# EAGLE design invader_midplate (EAGLE 9.5.0)
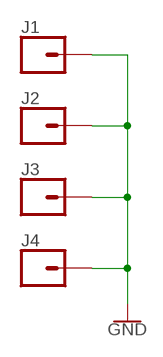
[diagram p0: schematic, sheet 1]

## Parts
J1  CONN_01PTH_NO_SILK_KIT  [1X01NS_KIT]
J2  CONN_01PTH_NO_SILK_KIT  [1X01NS_KIT]
J3  CONN_01PTH_NO_SILK_KIT  [1X01NS_KIT]
J4  CONN_01PTH_NO_SILK_KIT  [1X01NS_KIT]

## Nets
GND: J1.1 J2.1 J3.1 J4.1

## Library data of the parts
J1-J4 = SparkFun-Connectors:CONN_01: Single connection point. Often used as Generic Header-pin footprint for 0.1 inch spaced/style header connections On any of the 0.1 inch spaced packages, you can populate with these: Break Away Headers - Straight <https://www.sparkfun.com/products/116> (PRT-00116) Break Away Male Headers - Right Angle <https://www.sparkfun.com/products/553> (PRT-00553) Female Headers <https://www.sparkfun.com/products/115> (PRT-00115) Break Away Headers - Machine Pin <https://www.sparkfun.com/products/117> (PRT-00117) Break Away Female Headers - Swiss Machine Pin <https://www.sparkfun.com/products/743> (PRT-00743) This device is also useful as a general connection point to wire up your design to another part of your project. Our various solder wires solder well into these plated through hole pads. Hook-Up Wire - Assortment (Stranded, 22 AWG) <https://www.sparkfun.com/products/11375> (PRT-11375) Hook-Up Wire - Assortment (Solid Core, 22 AWG) <https://www.sparkfun.com/products/11367> (PRT-11367) View the entire wire category on our website here <https://www.sparkfun.com/categories/141> Special notes: SMTSO-256-ET is a "flush mount" nut for a 4-40 screw. We mostly use this on specialty testbeds; it is a nice way to connect hardware to your PCB at an adjustable hieght. Also note, the SNAP packages are for using a snappable style connector. We sell a baggie of snaps and they are also used on two LilyPad designs: Snap Assortment - 30 pack (male and female) <https://www.sparkfun.com/products/11347> (DEV-11347) LilyPad Arduino SimpleSnap <https://www.sparkfun.com/products/10941> (DEV-10941) LilyPad SimpleSnap Protoboard <https://www.sparkfun.com/products/10940> (DEV-10940)

## Net classes
0 default: width 0.152 mm
1 VCC: width 0.508 mm

## Board
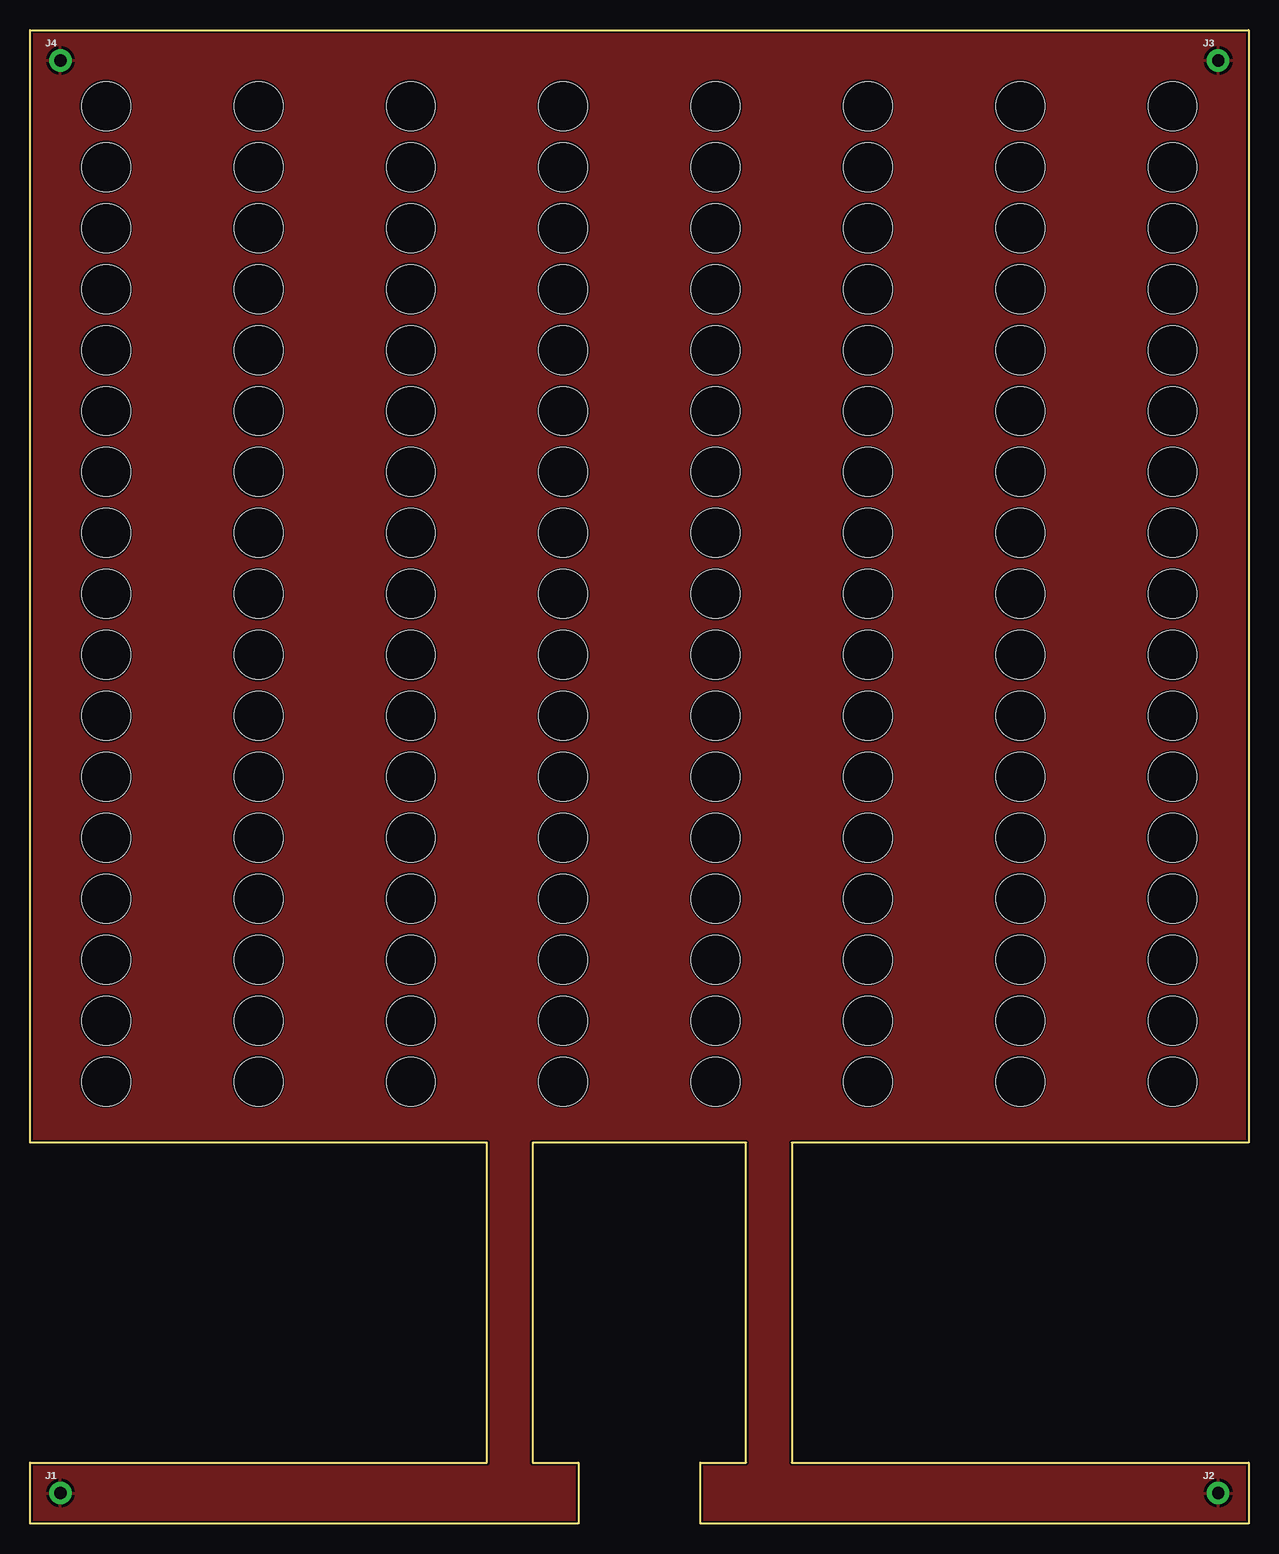
[diagram p1: board, top side]
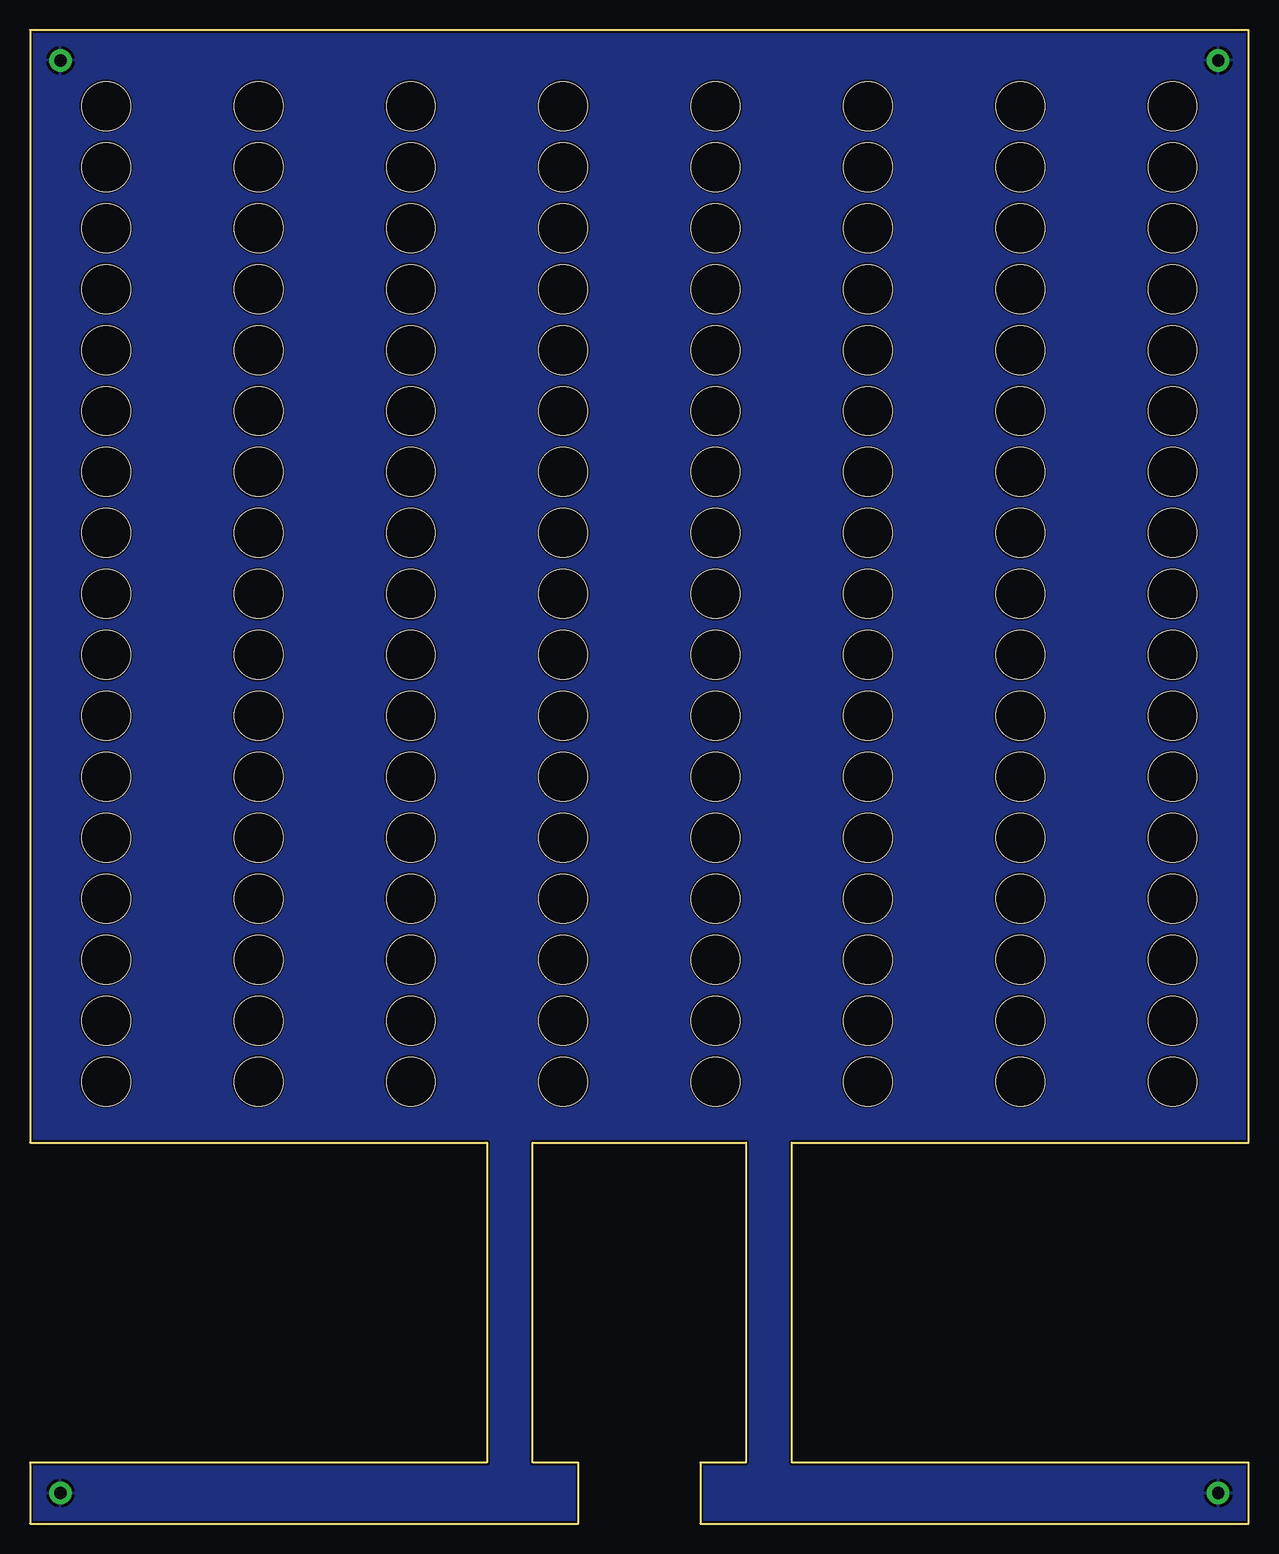
[diagram p2: board, bottom side, seen from below]

Size 101.6 x 124.46 mm. Coordinates in mm from the lower left corner, seen from the top.
Outline: 0,0 0,5.08 38.1,5.08 38.1,31.75 0,31.75 0,124.46 101.6,124.46 101.6,31.75 63.5,31.75 63.5,5.08 101.6,5.08 101.6,0 55.88,0 55.88,5.08 59.69,5.08 59.69,31.75 41.91,31.75 41.91,5.08 45.72,5.08 45.72,0 0,0
Copper layers (1*16): Top 0.035mm / dielectric 1.5mm / Bottom 0.035mm
Design rules "SparkFun-2-layer-PCBWay-LIMIT": minimum track width 6mil, minimum drill 0.3mm, track to track 6mil, track to pad 6mil, pad to pad 6mil, via to via 6mil, smd to smd 6mil, copper to edge 6mil, drill to drill 6mil, minimum pad ring 6mil, minimum via ring 6mil, stop-mask expansion 4mil, vias tented up to drill 25mil, thermal gap 10mil
Holes 4.06 mm at 6.35,118.11 19.05,118.11 31.75,118.11 44.45,118.11 57.15,118.11 69.85,118.11 82.55,118.11 95.25,118.11 6.35,113.03 19.05,113.03 31.75,113.03 44.45,113.03 57.15,113.03 69.85,113.03 82.55,113.03 95.25,113.03 6.35,107.95 19.05,107.95 31.75,107.95 44.45,107.95 57.15,107.95 69.85,107.95 82.55,107.95 95.25,107.95 6.35,102.87 19.05,102.87 31.75,102.87 44.45,102.87 57.15,102.87 69.85,102.87 82.55,102.87 95.25,102.87 6.35,97.79 19.05,97.79 31.75,97.79 44.45,97.79 57.15,97.79 69.85,97.79 82.55,97.79 95.25,97.79 6.35,92.71 19.05,92.71 31.75,92.71 44.45,92.71 57.15,92.71 69.85,92.71 82.55,92.71 95.25,92.71 6.35,87.63 19.05,87.63 31.75,87.63 44.45,87.63 57.15,87.63 69.85,87.63 82.55,87.63 95.25,87.63 6.35,82.55 19.05,82.55 31.75,82.55 44.45,82.55 57.15,82.55 69.85,82.55 82.55,82.55 95.25,82.55 6.35,77.47 19.05,77.47 31.75,77.47 44.45,77.47 57.15,77.47 69.85,77.47 82.55,77.47 95.25,77.47 6.35,72.39 19.05,72.39 31.75,72.39 44.45,72.39 57.15,72.39 69.85,72.39 82.55,72.39 95.25,72.39 6.35,67.31 19.05,67.31 31.75,67.31 44.45,67.31 57.15,67.31 69.85,67.31 82.55,67.31 95.25,67.31 6.35,62.23 19.05,62.23 31.75,62.23 44.45,62.23 57.15,62.23 69.85,62.23 82.55,62.23 95.25,62.23 6.35,57.15 19.05,57.15 31.75,57.15 44.45,57.15 57.15,57.15 69.85,57.15 82.55,57.15 95.25,57.15 6.35,52.07 19.05,52.07 31.75,52.07 44.45,52.07 57.15,52.07 69.85,52.07 82.55,52.07 95.25,52.07 6.35,46.99 19.05,46.99 31.75,46.99 44.45,46.99 57.15,46.99 69.85,46.99 82.55,46.99 95.25,46.99 6.35,41.91 19.05,41.91 31.75,41.91 44.45,41.91 57.15,41.91 69.85,41.91 82.55,41.91 95.25,41.91 6.35,36.83 19.05,36.83 31.75,36.83 44.45,36.83 57.15,36.83 69.85,36.83 82.55,36.83 95.25,36.83

### Footprints (pad centres in the part's own frame; a part is rotated, then mirrored left to right if it is on the bottom)
1X01NS_KIT = drill 1.016 pad 1.88: 1 0,0

### Placement (x,y rotation side)
J1  2.54,2.54 0 top
J2  99.06,2.54 0 top
J3  99.06,121.92 0 top
J4  2.54,121.92 0 top

### Tracks (layer width: path | path; a pad name or v marks a point on that pad's centre or on a via)
GND
  pour Top: 0,124.46 101.6,124.46 101.6,31.75 63.5,31.75 63.5,5.08 101.6,5.08 101.6,0 55.88,0 55.88,5.08 59.69,5.08 59.69,31.75 41.91,31.75 41.91,5.08 45.72,5.08 45.72,0 0,0 0,5.08 38.1,5.08 38.1,31.75 0,31.75
  pour Bottom: 0,124.46 101.6,124.46 101.6,31.75 63.5,31.75 63.5,5.08 101.6,5.08 101.6,0 55.88,0 55.88,5.08 59.69,5.08 59.69,31.75 41.91,31.75 41.91,5.08 45.72,5.08 45.72,0 0,0 0,5.08 38.1,5.08 38.1,31.75 0,31.75